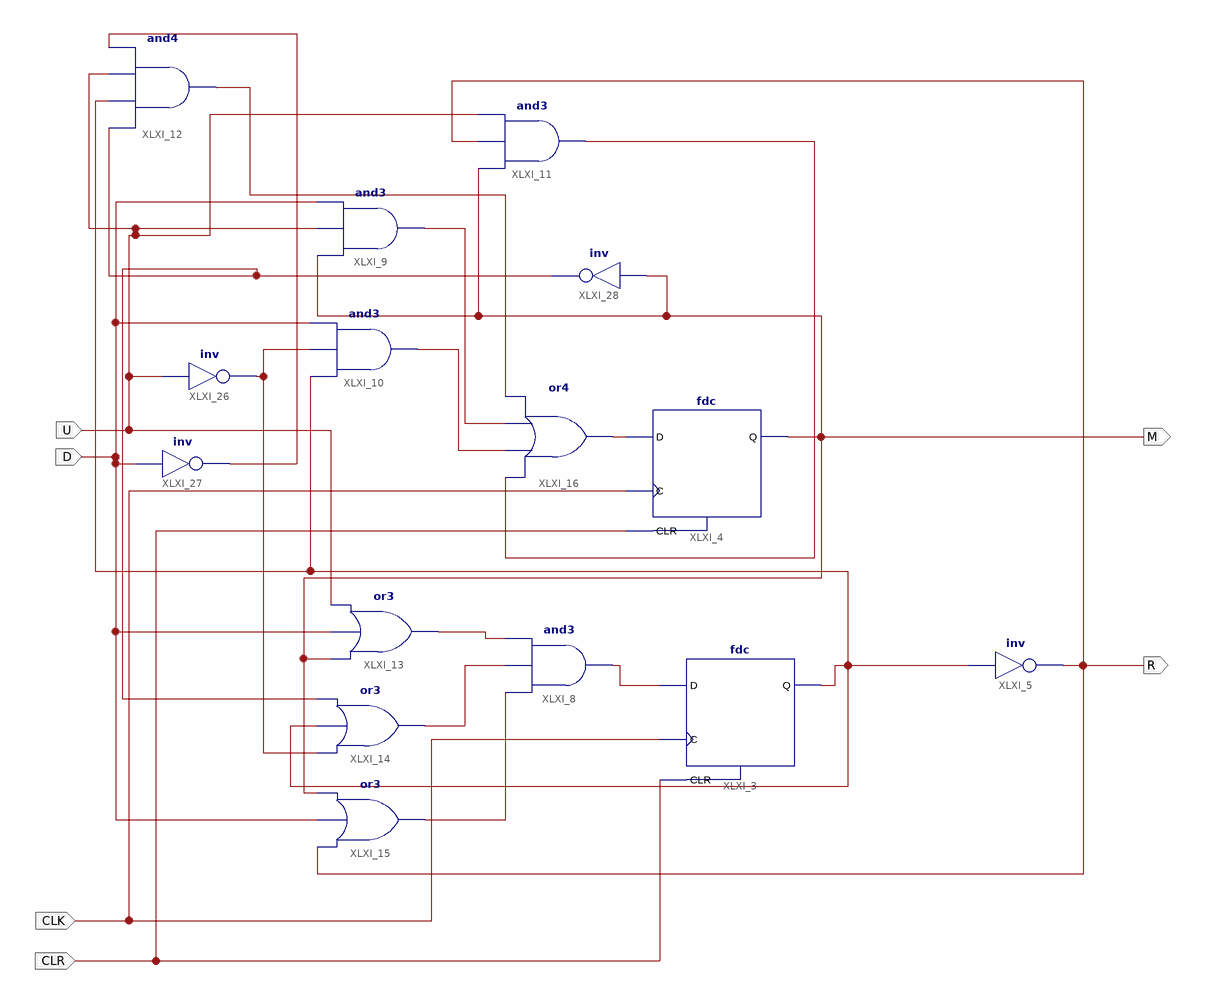
[diagram p0: schematic sheet 1]
// Xilinx ISE schematic ejA.sch (spartan3) as structural Verilog: 15 symbols, 6 ports
module ejA (
  input  CLR,
  input  CLK,
  input  U,
  input  D,
  output R,
  output M
);

  wire XLXN_14, XLXN_27, XLXN_31, XLXN_38, XLXN_39, XLXN_41, XLXN_42, XLXN_43, XLXN_44, XLXN_45, XLXN_46,
       XLXN_47, XLXN_48;

  not XLXI_5 (R, XLXN_39);
  or XLXI_13 (XLXN_46, M, D, U);
  or XLXI_14 (XLXN_47, XLXN_31, XLXN_39, XLXN_38);
  or XLXI_15 (XLXN_48, R, D, M);
  or XLXI_16 (XLXN_27, XLXN_45, XLXN_44, XLXN_43, XLXN_42);
  and XLXI_9 (XLXN_43, M, U, D);
  and XLXI_10 (XLXN_44, XLXN_39, XLXN_31, D);
  and XLXI_11 (XLXN_45, M, R, U);
  and XLXI_12 (XLXN_42, XLXN_38, XLXN_39, U, XLXN_41);
  and XLXI_8 (XLXN_14, XLXN_48, XLXN_47, XLXN_46);
  fdc XLXI_3 (.C(CLK), .CLR(CLR), .D(XLXN_14), .Q(XLXN_39));
  fdc XLXI_4 (.C(CLK), .CLR(CLR), .D(XLXN_27), .Q(M));
  not XLXI_26 (XLXN_31, U);
  not XLXI_27 (XLXN_41, D);
  not XLXI_28 (XLXN_38, M);
endmodule
